# Altium schematic sheet 20-RGMII ETHERNET PHY - ICSSG PRG2_PRU0.SchDoc
size 513 x 386 mm
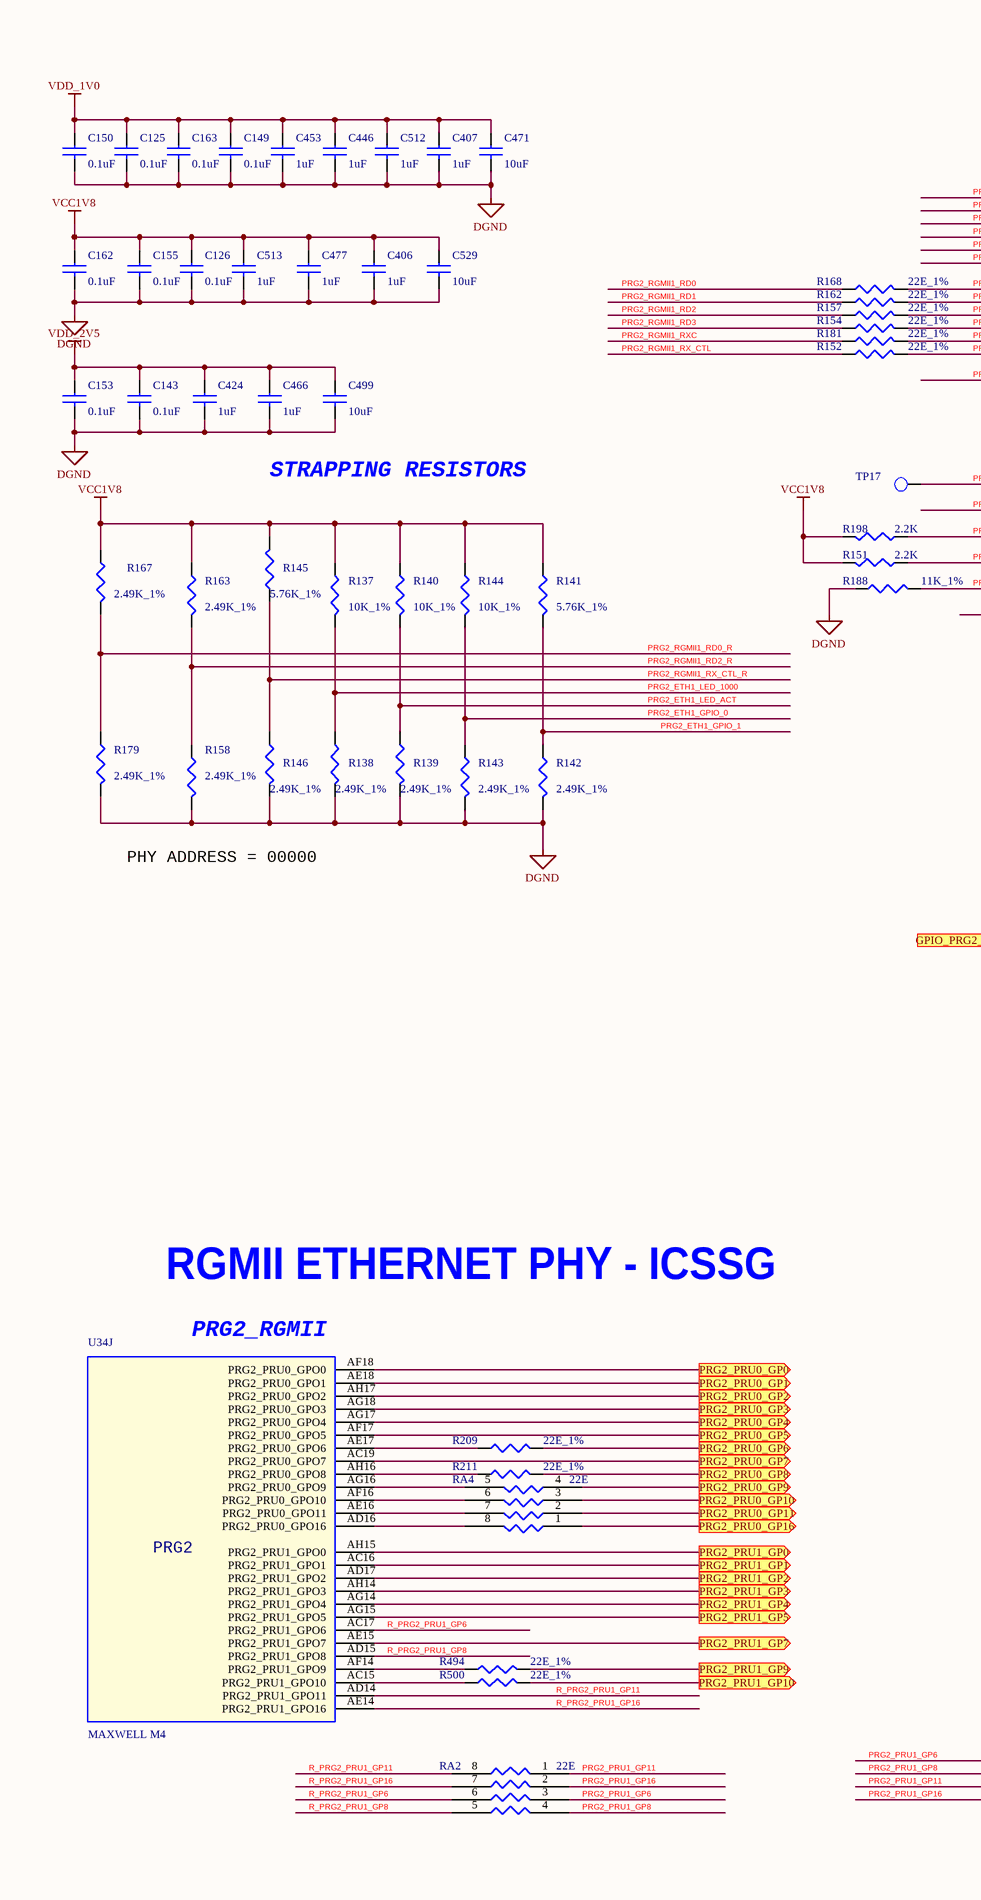
[diagram p0: 20-RGMII ETHERNET PHY - ICSSG PRG2_PRU0.SchDoc, left]
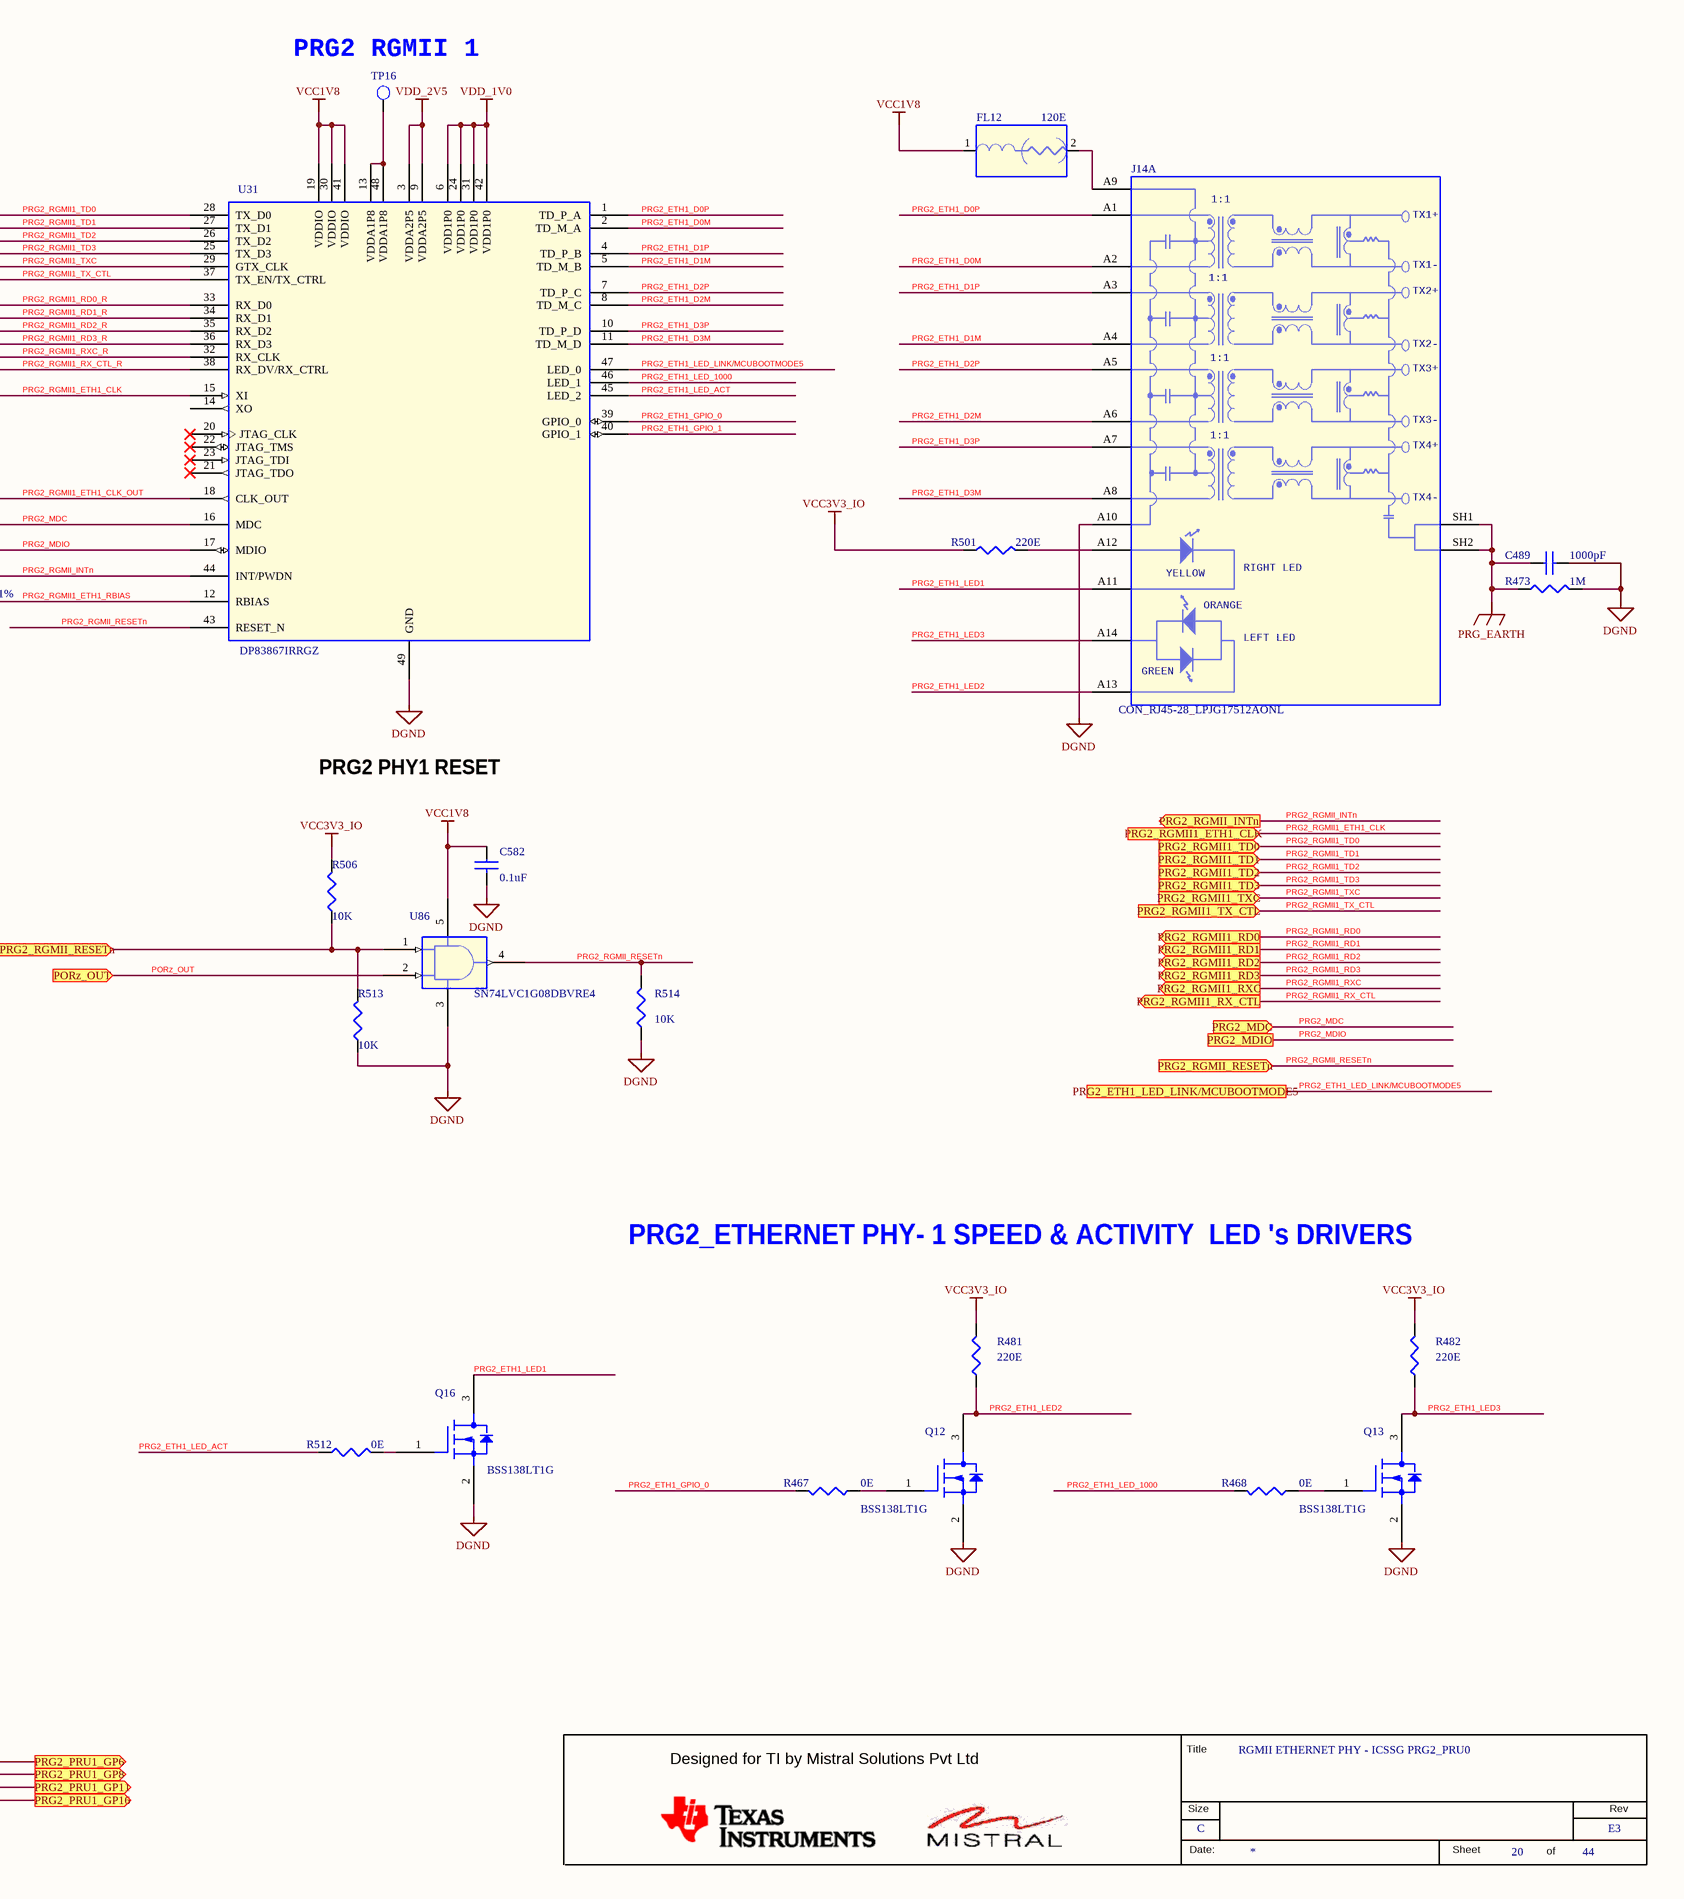
[diagram p1: 20-RGMII ETHERNET PHY - ICSSG PRG2_PRU0.SchDoc, right]

## Parts
*  RevCode: E3  Title: RGMII ETHERNET PHY - ICSSG PRG2_PRU0  Page Size: C  Page Number: 20  Page Count: 44  (hidden comment: MISTRAL_TITLEBLK_CSIZE)  (graphical)
C125  0.1uF  [CAP0201_0-5]
C126  0.1uF  [CAP0201_0-5]
C143  0.1uF  [CAP0201_0-5]
C149  0.1uF  [CAP0201_0-5]
C150  0.1uF  [CAP0201_0-5]
C153  0.1uF  [CAP0201_0-5]
C155  0.1uF  [CAP0201_0-5]
C162  0.1uF  [CAP0201_0-5]
C163  0.1uF  [CAP0201_0-5]
C406  1uF  [CAP0402_0-75]
C407  1uF  [CAP0402_0-75]
C424  1uF  [CAP0402_0-75]
C446  1uF  [CAP0402_0-75]
C453  1uF  [CAP0402_0-75]
C466  1uF  [CAP0402_0-75]
C471  10uF  [CAP0603_1]
C477  1uF  [CAP0402_0-75]
C489  1000pF  [CAP1206]
C499  10uF  [CAP0603_1]
C512  1uF  [CAP0402_0-75]
C513  1uF  [CAP0402_0-75]
C529  10uF  [CAP0603_1]
C582  0.1uF  [CAP0201_0-5]
FL12  120E  [EMIFIL_BLM15A_0402_0-6]
J14  CON_RJ45-28_LPJG17512AONL  [CON_RJ45-28_LPJG17512_S_R_T_25-3]  (part A of 2)
Q12  BSS138LT1G  [SOT23-123]
Q13  BSS138LT1G  [SOT23-123]
Q16  BSS138LT1G  [SOT23-123]
R137  10K_1%  [RES0402_0-5]
R138  2.49K_1%  [RES0402]
R139  2.49K_1%  [RES0402]
R140  10K_1%  [RES0402_0-5]
R141  5.76K_1%  [RES0402]
R142  2.49K_1%  [RES0402]
R143  2.49K_1%  [RES0402]
R144  10K_1%  [RES0402_0-5]
R145  5.76K_1%  [RES0402]
R146  2.49K_1%  [RES0402]
R151  2.2K  [RES0402_0-5]
R152  22E_1%  [RES0402]
R154  22E_1%  [RES0402]
R157  22E_1%  [RES0402]
R158  2.49K_1%  [RES0402]
R162  22E_1%  [RES0402]
R163  2.49K_1%  [RES0402]
R167  2.49K_1%  [RES0402]
R168  22E_1%  [RES0402]
R179  2.49K_1%  [RES0402]
R181  22E_1%  [RES0402]
R188  11K_1%  [RES0402_0-5]
R198  2.2K  [RES0402_0-5]
R209  22E_1%  [RES0402]
R211  22E_1%  [RES0402]
R467  0E  [RES0402_0-5]
R468  0E  [RES0402_0-5]
R473  1M  [RES0603_0-75]
R481  220E  [RES0402_0-5]
R482  220E  [RES0402_0-5]
R494  22E_1%  [RES0402]
R500  22E_1%  [RES0402]
R501  220E  [RES0402_0-5]
R506  10K  [RES0402_0-5]
R512  0E  [RES0402_0-5]
R513  10K  [RES0402_0-5]
R514  10K  [RES0402_0-5]
RA2  22E  [RESA_EXB28V_0402-4_0-5]
RA4  22E  [RESA_EXB28V_0402-4_0-5]
TP16  TP40_SMD  [TP40_SMD]  (value not drawn)
TP17  TP40_SMD  [TP40_SMD]  (value not drawn)
U31  DP83867IRRGZ  [QFN48_19-68_280X280_1]
U34  MAXWELL M4  [BGA784_31-49_910X910_1-7]  (part J of 19)
U86  SN74LVC1G08DBVRE4  [SOT23-5]

## Ports
GPIO_PRG2_RGMII_RESETn (in), PORz_OUT (in), PRG2_ETH1_LED_LINK/MCUBOOTMODE5, PRG2_MDC (in), PRG2_MDIO, PRG2_PRU0_GP0 (out), PRG2_PRU0_GP1 (out), PRG2_PRU0_GP2 (out), PRG2_PRU0_GP3 (out), PRG2_PRU0_GP4 (out), PRG2_PRU0_GP5 (out), PRG2_PRU0_GP6 (out), PRG2_PRU0_GP7 (out), PRG2_PRU0_GP8 (out), PRG2_PRU0_GP9 (out), PRG2_PRU0_GP10 (out), PRG2_PRU0_GP11 (out), PRG2_PRU0_GP16 (out), PRG2_PRU1_GP0 (out), PRG2_PRU1_GP1 (out), PRG2_PRU1_GP2 (out), PRG2_PRU1_GP3 (out), PRG2_PRU1_GP4 (out), PRG2_PRU1_GP5 (out), PRG2_PRU1_GP6 (out), PRG2_PRU1_GP7 (out), PRG2_PRU1_GP8 (out), PRG2_PRU1_GP9 (out), PRG2_PRU1_GP10 (out), PRG2_PRU1_GP11 (out), PRG2_PRU1_GP16 (out), PRG2_RGMII1_ETH1_CLK (in), PRG2_RGMII1_RD0 (out), PRG2_RGMII1_RD1 (out), PRG2_RGMII1_RD2 (out), PRG2_RGMII1_RD3 (out), PRG2_RGMII1_RX_CTL (out), PRG2_RGMII1_RXC (out), PRG2_RGMII1_TD0 (in), PRG2_RGMII1_TD1 (in), PRG2_RGMII1_TD2 (in), PRG2_RGMII1_TD3 (in), PRG2_RGMII1_TX_CTL (in), PRG2_RGMII1_TXC (in), PRG2_RGMII_INTn (out), PRG2_RGMII_RESETn (in)

## Nets
DGND: C125.2 C126.2 C143.2 C149.2 C150.2 C153.2 C155.2 C162.2 C163.2 C406.2 C407.2 C424.2 C446.2 C453.2 C466.2 C471.2 C477.2 C489.2 C499.2 C512.2 C513.2 C529.2 C582.2 J14.A10(GND) Q12.2(S) Q13.2(S) Q16.2(S) R138.2 R139.2 R142.2 R143.2 R146.2 R158.2 R179.2 R188.2 R473.2 R513.1 R514.2 U31.49(GND) U86.3(GND)
PRG_EARTH: C489.1 J14.SH1 J14.SH2 R473.1
VCC1V8: C126.1 C155.1 C162.1 C406.1 C477.1 C513.1 C529.1 C582.1 FL12.1 R137.1 R140.1 R141.1 R144.1 R145.2 R151.2 R163.1 R167.1 R198.2 U31.19(VDDIO) U31.30(VDDIO) U31.41(VDDIO) U86.5(VCC)
VCC3V3_IO: R481.2 R482.2 R501.1 R506.2
VDD_1V0: C125.1 C149.1 C150.1 C163.1 C407.1 C446.1 C453.1 C471.1 C512.1 U31.6(VDD1P0) U31.24(VDD1P0) U31.31(VDD1P0) U31.42(VDD1P0)
VDD_2V5: C143.1 C153.1 C424.1 C466.1 C499.1 U31.3(VDDA2P5) U31.9(VDDA2P5)
GPIO_PRG2_RGMII_RESETn: R506.1 R513.2 U86.1(A) ; port GPIO_PRG2_RGMII_RESETn
PORz_OUT: U86.2(B) ; port PORz_OUT
PRG2_ETH1_D0M: J14.A2(TD1-_1) U31.2(TD_M_A)
PRG2_ETH1_D0P: J14.A1(TD1+_1) U31.1(TD_P_A)
PRG2_ETH1_D1M: J14.A4(TD2-_1) U31.5(TD_M_B)
PRG2_ETH1_D1P: J14.A3(TD2+_1) U31.4(TD_P_B)
PRG2_ETH1_D2M: J14.A6(TD3-_1) U31.8(TD_M_C)
PRG2_ETH1_D2P: J14.A5(TD3+_1) U31.7(TD_P_C)
PRG2_ETH1_D3M: J14.A8(TD4-_1) U31.11(TD_M_D)
PRG2_ETH1_D3P: J14.A7(TD4+_1) U31.10(TD_P_D)
PRG2_ETH1_GPIO_0: R143.1 R144.2 R467.2 U31.39(GPIO_0)
PRG2_ETH1_GPIO_1: R141.2 R142.1 U31.40(GPIO_1)
PRG2_ETH1_LED1: J14.A11 Q16.3(D)
PRG2_ETH1_LED2: J14.A13 Q12.3(D) R481.1
PRG2_ETH1_LED3: J14.A14 Q13.3(D) R482.1
PRG2_ETH1_LED_1000: R137.2 R138.1 R468.2 U31.46(LED_1)
PRG2_ETH1_LED_ACT: R139.1 R140.2 R512.1 U31.45(LED_2)
PRG2_ETH1_LED_LINK/MCUBOOTMODE5: U31.47(LED_0) ; port PRG2_ETH1_LED_LINK/MCUBOOTMODE5
PRG2_MDC: U31.16(MDC) ; port PRG2_MDC
PRG2_MDIO: R198.1 U31.17(MDIO) ; port PRG2_MDIO
PRG2_PRU0_GP0: U34.AF18(PRG2_PRU0_GPO0) ; port PRG2_PRU0_GP0
PRG2_PRU0_GP1: U34.AE18(PRG2_PRU0_GPO1) ; port PRG2_PRU0_GP1
PRG2_PRU0_GP2: U34.AH17(PRG2_PRU0_GPO2) ; port PRG2_PRU0_GP2
PRG2_PRU0_GP3: U34.AG18(PRG2_PRU0_GPO3) ; port PRG2_PRU0_GP3
PRG2_PRU0_GP4: U34.AG17(PRG2_PRU0_GPO4) ; port PRG2_PRU0_GP4
PRG2_PRU0_GP5: U34.AF17(PRG2_PRU0_GPO5) ; port PRG2_PRU0_GP5
PRG2_PRU0_GP6: R209.2 ; port PRG2_PRU0_GP6
PRG2_PRU0_GP7: U34.AC19(PRG2_PRU0_GPO7) ; port PRG2_PRU0_GP7
PRG2_PRU0_GP8: R211.2 ; port PRG2_PRU0_GP8
PRG2_PRU0_GP9: RA4.4 ; port PRG2_PRU0_GP9
PRG2_PRU0_GP10: RA4.3 ; port PRG2_PRU0_GP10
PRG2_PRU0_GP11: RA4.2 ; port PRG2_PRU0_GP11
PRG2_PRU0_GP16: RA4.1 ; port PRG2_PRU0_GP16
PRG2_PRU1_GP0: U34.AH15(PRG2_PRU1_GPO0) ; port PRG2_PRU1_GP0
PRG2_PRU1_GP1: U34.AC16(PRG2_PRU1_GPO1) ; port PRG2_PRU1_GP1
PRG2_PRU1_GP2: U34.AD17(PRG2_PRU1_GPO2) ; port PRG2_PRU1_GP2
PRG2_PRU1_GP3: U34.AH14(PRG2_PRU1_GPO3) ; port PRG2_PRU1_GP3
PRG2_PRU1_GP4: U34.AG14(PRG2_PRU1_GPO4) ; port PRG2_PRU1_GP4
PRG2_PRU1_GP5: U34.AG15(PRG2_PRU1_GPO5) ; port PRG2_PRU1_GP5
PRG2_PRU1_GP6: RA2.3 ; port PRG2_PRU1_GP6
PRG2_PRU1_GP7: U34.AE15(PRG2_PRU1_GPO7) ; port PRG2_PRU1_GP7
PRG2_PRU1_GP8: RA2.4 ; port PRG2_PRU1_GP8
PRG2_PRU1_GP9: R494.2 ; port PRG2_PRU1_GP9
PRG2_PRU1_GP10: R500.2 ; port PRG2_PRU1_GP10
PRG2_PRU1_GP11: RA2.1 ; port PRG2_PRU1_GP11
PRG2_PRU1_GP16: RA2.2 ; port PRG2_PRU1_GP16
PRG2_RGMII1_ETH1_CLK: U31.15(XI) ; port PRG2_RGMII1_ETH1_CLK
PRG2_RGMII1_ETH1_CLK_OUT: TP17.1(TP) U31.18(CLK_OUT)
PRG2_RGMII1_ETH1_RBIAS: R188.1 U31.12(RBIAS)
PRG2_RGMII1_RD0: R168.1 ; port PRG2_RGMII1_RD0
PRG2_RGMII1_RD0_R: R167.2 R168.2 R179.1 U31.33(RX_D0)
PRG2_RGMII1_RD1: R162.1 ; port PRG2_RGMII1_RD1
PRG2_RGMII1_RD1_R: R162.2 U31.34(RX_D1)
PRG2_RGMII1_RD2: R157.1 ; port PRG2_RGMII1_RD2
PRG2_RGMII1_RD2_R: R157.2 R158.1 R163.2 U31.35(RX_D2)
PRG2_RGMII1_RD3: R154.1 ; port PRG2_RGMII1_RD3
PRG2_RGMII1_RD3_R: R154.2 U31.36(RX_D3)
PRG2_RGMII1_RX_CTL: R152.1 ; port PRG2_RGMII1_RX_CTL
PRG2_RGMII1_RX_CTL_R: R145.1 R146.1 R152.2 U31.38(RX_DV/RX_CTRL)
PRG2_RGMII1_RXC: R181.1 ; port PRG2_RGMII1_RXC
PRG2_RGMII1_RXC_R: R181.2 U31.32(RX_CLK)
PRG2_RGMII1_TD0: U31.28(TX_D0) ; port PRG2_RGMII1_TD0
PRG2_RGMII1_TD1: U31.27(TX_D1) ; port PRG2_RGMII1_TD1
PRG2_RGMII1_TD2: U31.26(TX_D2) ; port PRG2_RGMII1_TD2
PRG2_RGMII1_TD3: U31.25(TX_D3) ; port PRG2_RGMII1_TD3
PRG2_RGMII1_TX_CTL: U31.37(TX_EN/TX_CTRL) ; port PRG2_RGMII1_TX_CTL
PRG2_RGMII1_TXC: U31.29(GTX_CLK) ; port PRG2_RGMII1_TXC
PRG2_RGMII_INTn: R151.1 U31.44(INT/PWDN) ; port PRG2_RGMII_INTn
PRG2_RGMII_RESETn: R514.1 U31.43(RESET_N) U86.4(Y) ; port PRG2_RGMII_RESETn
R_PRG2_PRU1_GP6: RA2.6 U34.AC17(PRG2_PRU1_GPO6)
R_PRG2_PRU1_GP8: RA2.5 U34.AD15(PRG2_PRU1_GPO8)
R_PRG2_PRU1_GP11: RA2.8 U34.AD14(PRG2_PRU1_GPO11)
R_PRG2_PRU1_GP16: RA2.7 U34.AE14(PRG2_PRU1_GPO16)
NetFL12_2: FL12.2 J14.A9(VCC)
NetJ14_A12: J14.A12 R501.2
NetQ12_1: Q12.1(G) R467.1
NetQ13_1: Q13.1(G) R468.1
NetQ16_1: Q16.1(G) R512.2
NetR209_1: R209.1 U34.AE17(PRG2_PRU0_GPO6)
NetR211_1: R211.1 U34.AH16(PRG2_PRU0_GPO8)
NetR494_1: R494.1 U34.AF14(PRG2_PRU1_GPO9)
NetR500_1: R500.1 U34.AC15(PRG2_PRU1_GPO10)
NetRA4_5: RA4.5 U34.AG16(PRG2_PRU0_GPO9)
NetRA4_6: RA4.6 U34.AF16(PRG2_PRU0_GPO10)
NetRA4_7: RA4.7 U34.AE16(PRG2_PRU0_GPO11)
NetRA4_8: RA4.8 U34.AD16(PRG2_PRU0_GPO16)
NetTP16_1: TP16.1(TP) U31.13(VDDA1P8) U31.48(VDDA1P8)

Not connected (* = marked no-connect by the designer): U31 14(XO) 20(JTAG_CLK)* 21(JTAG_TDO)* 22(JTAG_TMS)* 23(JTAG_TDI)*

## Notes on the sheet
- (near TP16) PRG2 RGMII 1
- STRAPPING RESISTORS
- PRG2 PHY1 RESET
- PHY ADDRESS = 00000
- PRG2_ETHERNET PHY- 1 SPEED & ACTIVITY  LED 's DRIVERS
- RGMII ETHERNET PHY - ICSSG
- (near U34) PRG2_RGMII
- (in symbol AM654X_BGA784, part J) PRG2
- (in symbol CON_RJ45-28_LPJG17512AONL, part A) 1:1; TX1+; TX1-; TX2+; TX2-; TX3+; TX3-; TX4+; TX4-; RIGHT LED; YELLOW; ORANGE; LEFT LED; GREEN
- (in symbol MISTRAL_TITLEBLK_CSIZE) Title; Designed for TI by Mistral Solutions Pvt Ltd; Size; Rev; Date:; Sheet; of

## Library data of the parts
* = MISTRAL_TITLEBLK_CSIZE: Issue: 1.0; Page Create Date: March  8, 1995; Page Modify Date: *
C125 C150 C153 C582 = CAP_Dup5: CAP CERAMIC 0.1uF 16V 10% X5R 0201; Part_type: CAPACITORS\CERAMIC; Mfr_part_number: GRM033R61C104KE84J; Mfr_name: MURATA; Mistral Part No: 120009030072-R; Custom_Duty: 15%; Customs_HS_Code: 85322990; Wattage: NA; Project: TI_MAXIE_CPB; Library Ref: CAP; PCB Footprint: CAP0201_0-5; MECHANICAL 3D STEP FILE: CAP0201_0-5; Chkd/date: MANIRAJA/120218; Crtd /date: MANIRAJA/120218; Datasheet: Y:\MIS_DATABASE\DATASHEETS\CAPACITORS\GRM033R61C104KE84.PDF; Temperature: -55°C+85°C; Weight: 0.33mg; Height: 0.33MM; Distributor_part_number: 490-16742-1-ND; Distributor_name: DIGIKEY; Package: 0201; Voltage: 16V; Tolerance: 10%
C126 C143 C149 C155 C162 C163 = CAP_Dup5: CAP CERAMIC 0.1uF 16V 10% X5R 0201; Mistral Part No: 120009030072-R; Mfr_name: MURATA; Mfr_part_number: GRM033R61C104KE84J; Part_type: CAPACITORS\CERAMIC; Project: TI_MAXIE_CPB; Wattage: NA; Customs_HS_Code: 85322990; Custom_Duty: 15%; Library Ref: CAP; PCB Footprint: CAP0201_0-5; Tolerance: 10%; Voltage: 16V; Package: 0201; Distributor_name: DIGIKEY; Distributor_part_number: 490-16742-1-ND; Height: 0.33MM; Weight: 0.33mg; Temperature: -55°C+85°C; Datasheet: Y:\MIS_DATABASE\DATASHEETS\CAPACITORS\GRM033R61C104KE84.PDF; Crtd /date: MANIRAJA/120218; Chkd/date: MANIRAJA/120218; MECHANICAL 3D STEP FILE: CAP0201_0-5
C406 C407 C446 C477 C513 = CAP_Dup5: CAP CERAMIC 1uF 16V 20% X5R 0402; Mistral Part No: 120018020006-R; Mfr_name: TAIYO YUDEN; Mfr_part_number: EMK105BJ105MV-F; Part_type: CAPACITORS\CERAMIC; Project: TI_MAXIE_CPB; Wattage: NA; Customs_HS_Code: 85322990; Custom_Duty: 15%; Footprint Ref: CAP0402_0-75; Library Ref: CAP; Footprint Path: Y:\MIS_DATABASE\Library\ALTIUM_TOOL\PCB_FOOTPRINTS\Altium_Footprint_Lib.PcbLib; Library Path: Y:\MIS_DATABASE\Library\ALTIUM_TOOL\SCHEMATICS_PARTS\MS_DISCRETE_Library.schlib; MECHANICAL 3D STEP FILE: CAP0402_0-75; PCB Footprint: CAP0402_0-75; Tolerance: 20%; Voltage: 16V; Package: 0402; Distributor_name: DIGIKEY; Distributor_part_number: 587-5514-1-ND; Height: 0.55MM; Weight: 0.65mg; Temperature: -55°C+85°C; Datasheet: Y:\MIS_DATABASE\DATASHEETS\CAPACITORS\EMK105BJ105MV-F.PDF; Crtd /date: ALVY/150218; Chkd/date: MANIRAJA/150218
C424 C453 C466 C512 = CAP_Dup5: CAP CERAMIC 1uF 16V 20% X5R 0402; Part_type: CAPACITORS\CERAMIC; Mfr_part_number: EMK105BJ105MV-F; Mfr_name: TAIYO YUDEN; Mistral Part No: 120018020006-R; Custom_Duty: 15%; Customs_HS_Code: 85322990; Wattage: NA; Project: TI_MAXIE_CPB; Footprint Ref: CAP0402_0-75; Library Ref: CAP; Footprint Path: Y:\MIS_DATABASE\Library\ALTIUM_TOOL\PCB_FOOTPRINTS\Altium_Footprint_Lib.PcbLib; Library Path: Y:\MIS_DATABASE\Library\ALTIUM_TOOL\SCHEMATICS_PARTS\MS_DISCRETE_Library.schlib; MECHANICAL 3D STEP FILE: CAP0402_0-75; PCB Footprint: CAP0402_0-75; Chkd/date: MANIRAJA/150218; Crtd /date: ALVY/150218; Datasheet: Y:\MIS_DATABASE\DATASHEETS\CAPACITORS\EMK105BJ105MV-F.PDF; Temperature: -55°C+85°C; Weight: 0.65mg; Height: 0.55MM; Distributor_part_number: 587-5514-1-ND; Distributor_name: DIGIKEY; Package: 0402; Voltage: 16V; Tolerance: 20%
C471 = CAP_Dup5: CAP CERAMIC 10uF 10V 10% X5R 0603; Mistral Part No: 120010080001-R; Mfr_name: AVX CORPORATION; Mfr_part_number: 0603ZD106KAT2A; Part_type: CAPACITORS\CERAMIC; Project: TI_MAXIE_CPB; Customs_HS_Code: 85322990; Custom_Duty: 15%; Wattage: NA; Library Ref: CAP; PCB Footprint: CAP0603_1; Tolerance: 10%; Voltage: 10V; Package: 0603; Distributor_name: DIGIKEY; Distributor_part_number: 478-10766-1-ND; Height: 0.94MM; Datasheet: Y:\MIS_DATABASE\DATASHEETS\CAPACITORS\AVX_MLC.PDF; Crtd /date: MANIRAJA/230118; Chkd/date: MANIRAJA/230118; Weight: 2mg; Temperature: -55°C+85°C; MECHANICAL 3D STEP FILE: CAP0603_1
C489 = CAP_Dup5: CAP CERAMIC 1000pF 2KV 10% X7R 1206; Mistral Part No: 120009030147-R; Mfr_name: AVX CORPORATION; Mfr_part_number: 1206GC102KAT1A; Part_type: CAPACITORS\CERAMIC; Project: ADR1B; Customs_HS_Code: 85322990; Custom_Duty: 15%; Footprint Path: Y:\MIS_DATABASE\Library\ALTIUM_TOOL\PCB_FOOTPRINTS\Altium_Footprint_Lib.PcbLib; Library Path: Y:\MIS_DATABASE\Library\ALTIUM_TOOL\SCHEMATICS_PARTS\MS_DISCRETE_Library.schlib; Footprint Ref: CAP1206; Library Ref: CAP; Tolerance: 10%; Voltage: 2KV; Package: 1206; Distributor_name: DIGIKEY; Distributor_part_number: 478-2956-1-ND; Height: 1.50MM; Weight: NA; Temperature: -55°C+125°C; Datasheet: Y:\MIS_DATABASE\DATASHEETS\CAPACITORS\AVX_MLC.PDF; Crtd /date: MAZHAR/281106; Chkd/date: SHREESHAIL/291106; PCB Footprint: CAP1206
C499 = CAP_Dup5: CAP CERAMIC 10uF 10V 10% X5R 0603; Part_type: CAPACITORS\CERAMIC; Mfr_part_number: 0603ZD106KAT2A; Mfr_name: AVX CORPORATION; Mistral Part No: 120010080001-R; Wattage: NA; Custom_Duty: 15%; Customs_HS_Code: 85322990; Project: TI_MAXIE_CPB; Library Ref: CAP; PCB Footprint: CAP0603_1; MECHANICAL 3D STEP FILE: CAP0603_1; Temperature: -55°C+85°C; Weight: 2mg; Chkd/date: MANIRAJA/230118; Crtd /date: MANIRAJA/230118; Datasheet: Y:\MIS_DATABASE\DATASHEETS\CAPACITORS\AVX_MLC.PDF; Height: 0.94MM; Distributor_part_number: 478-10766-1-ND; Distributor_name: DIGIKEY; Package: 0603; Voltage: 10V; Tolerance: 10%
C529 = CAP_Dup5: CAP CERAMIC 10uF 10V 10% X5R 0603; Mistral Part No: 120010080001-R; Mfr_name: AVX CORPORATION; Mfr_part_number: 0603ZD106KAT2A; Part_type: CAPACITORS\CERAMIC; Wattage: NA; Project: TI_MAXIE_CPB; Customs_HS_Code: 85322990; Custom_Duty: 15%; Library Ref: CAP; PCB Footprint: CAP0603_1; MECHANICAL 3D STEP FILE: CAP0603_1; Temperature: -55°C+85°C; Weight: 2mg; Tolerance: 10%; Voltage: 10V; Package: 0603; Distributor_name: DIGIKEY; Distributor_part_number: 478-10766-1-ND; Height: 0.94MM; Datasheet: Y:\MIS_DATABASE\DATASHEETS\CAPACITORS\AVX_MLC.PDF; Crtd /date: MANIRAJA/230118; Chkd/date: MANIRAJA/230118
FL12 = EMIFILTER_IND: FERRITE CHIP 120E 1.3A 0402; Part_type: MISC\FILTER; Mfr_part_number: BLM15PD121SN1; Mfr_name: MURATA; Mistral Part No: 130012030043-R; Custom_Duty: 24%; Customs_HS_Code: 85437099; Wattage: NA; Tolerance: 25%; Project: GEN_3-8; Footprint Path: Y:\MIS_DATABASE\Library\ALTIUM_TOOL\PCB_FOOTPRINTS\Altium_Footprint_Lib.PcbLib; Library Path: Y:\MIS_DATABASE\Library\ALTIUM_TOOL\SCHEMATICS_PARTS\MS_FILTER_Library.schlib; Footprint Ref: EMIFIL_BLM15A_0402_0-6; Library Ref: EMIFILTER_IND; PCB Footprint: EMIFIL_BLM15A_0402_0-6; MECHANICAL 3D STEP FILE: EMIFIL_BLM15A_0402_0-6; Chkd/date: VASANTHA/010117; Crtd /date: CHAITHANYA/150312; Datasheet: Y:\MIS_DATABASE\DATASHEETS\DISCRETES\INDUCTORS\BLM18K-SERIES.PDF; Temperature: -55°C+125°C; Weight: 0.65mg; Height: 0.55MM; Distributor_part_number: 490-5203-1-ND; Distributor_name: DIGIKEY; Package: 0402; Voltage: NA
J14 = CON_RJ45-28_LPJG17512AONL: CON JACK RJ45 28POS REGISTERED FEMALE RA TH; Part_type: CONNECTOR\JACK; Mfr_name: LINK-PP; Mistral Part No: 150017080001-R; Custom_Duty: 24%; Customs_HS_Code: 85369090; Wattage: NA; Project: TI_SVB_DUT; Library Ref: CON_RJ45-28_LPJG17512AONL; PCB Footprint: CON_RJ45-28_LPJG17512_S_R_T_25-3; MECHANICAL 3D STEP FILE: CON_RJ45-28_LPJG17512_S_R_T_25-3; Chkd/date: MANIRAJA/010817; Crtd /date: MANIRAJA/010817; Datasheet: Y:\MIS_DATABASE\DATASHEETS\CONNECTORS\LPJG17512AONL.PDF; Temperature: 0°C+70°C; Weight: NA; Height: 25.30MM; Distributor_part_number: NA; Distributor_name: NA; Package: THRU-HOLE; Voltage: NA; Tolerance: NA; Mfr_part_number: LPJG17512AONL
Q12 Q16 = MOSFET_BSS138LT1G: IC MOSFET N-CHANNEL 50V, SOT23-3; Part_type: ICS\POWER\MOSFET; Mfr_name: ON SEMICONDUCTOR; Mistral Part No: 142016040001-R; Custom_Duty: 15%; Customs_HS_Code: 85423100; Wattage: NA; Project: LRDE_ABCM; Library Ref: MOSFET_BSS138LT1G; PCB Footprint: SOT23-123; Chkd/date: VASANTHA/150416; Crtd /date: JEBRAN/060416; Datasheet: Y:\MIS_DATABASE\DATASHEETS\DISCRETES\TRANSISTORS_FETS\BSS138LT1G.PDF; Temperature: -55°C+150°C; Weight: NA; Height: 1.11MM; Distributor_part_number: 863-BSS138LT1G; Distributor_name: MOUSER; Package: SOT23-3; Voltage: 50V; Tolerance: NA; Mfr_part_number: BSS138LT1G
Q13 = MOSFET_BSS138LT1G: IC MOSFET N-CHANNEL 50V, SOT23-3; Mistral Part No: 142016040001-R; Mfr_name: ON SEMICONDUCTOR; Part_type: ICS\POWER\MOSFET; Project: LRDE_ABCM; Tolerance: NA; Customs_HS_Code: 85423100; Custom_Duty: 15%; Library Ref: MOSFET_BSS138LT1G; PCB Footprint: SOT23-123; Mfr_part_number: BSS138LT1G; Voltage: 50V; Wattage: NA; Package: SOT23-3; Distributor_name: MOUSER; Distributor_part_number: 863-BSS138LT1G; Height: 1.11MM; Weight: NA; Temperature: -55°C+150°C; Datasheet: Y:\MIS_DATABASE\DATASHEETS\DISCRETES\TRANSISTORS_FETS\BSS138LT1G.PDF; Crtd /date: JEBRAN/060416; Chkd/date: VASANTHA/150416
R137 R140 = RESISTOR_Dup5: RES 10K 1/16W 1% 0402; Mistral Part No: 110009030220-P; Mfr_name: YAGEO AMERICA; Mfr_part_number: RC0402FR-0710KL; Part_type: RESISTORS\FIXED; Project: VOCERA; Voltage: NA; Customs_HS_Code: 85332119; Custom_Duty: 15%; NI_MARK: DNI; Footprint Path: Y:\MIS_DATABASE\Library\ALTIUM_TOOL\PCB_FOOTPRINTS\Altium_Footprint_Lib.PcbLib; Library Path: Y:\MIS_DATABASE\Library\ALTIUM_TOOL\SCHEMATICS_PARTS\MS_DISCRETE_Library.schlib; Footprint Ref: RES0402_0-5; Library Ref: RESISTOR; MECHANICAL 3D STEP FILE: RES0402_0-5; Tolerance: 1%; Wattage: 1/16W; Package: 0402; Distributor_name: DIGIKEY; Distributor_part_number: 311-10.0KLRTR-ND; Height: 0.40MM; Weight: 0.65mg; Temperature: -55°C+155°C; Datasheet: Y:\MIS_DATABASE\DATASHEETS\RESISTORS\YAGEO-RC0402.PDF; Crtd /date: GEETHA/290506; Chkd/date: VASANTHA/201216; RoHS: Pb-Free; PCB Footprint: RES0402_0-5
R138 R139 R179 = RESISTOR_Dup5: RES 2.49K 1/16W 1% 0402; Mistral Part No: 110016050020-R; Mfr_name: YAGEO AMERICA; Mfr_part_number: RC0402FR-072K49L; Part_type: RESISTORS\FIXED; Project: TMDXCSKCC; Voltage: NA; Customs_HS_Code: 85332119; Custom_Duty: 15%; NI_MARK: DNI; Library Ref: RESISTOR; Tolerance: 1%; Wattage: 1/16W; Package: 0402; Distributor_name: DIGIKEY; Distributor_part_number: 311-2.49KLRCT-ND; Height: 0.40MM; Weight: NA; Temperature: -55°C+155°C; Datasheet: Y:\MIS_DATABASE\DATASHEETS\RESISTORS\RC0402FR.PDF; Crtd /date: VASANTHA/270516; Chkd/date: VASANTHA/270516; PCB Footprint: RES0402
R141 = RESISTOR_Dup5: RES 5.76K 1/10W 1% 0402; Part_type: RESISTORS\FIXED; Mfr_part_number: ERJ-2RKF5761X; Mfr_name: PANASONIC-ECG; Mistral Part No: 110009030945-R; Custom_Duty: 15%; Customs_HS_Code: 85332119; Project: CPB; NI_MARK: DNI; Footprint Path: Y:\MIS_DATABASE\Library\ALTIUM_TOOL\PCB_FOOTPRINTS\Altium_Footprint_Lib.PcbLib; Library Path: Y:\MIS_DATABASE\Library\ALTIUM_TOOL\SCHEMATICS_PARTS\MS_DISCRETE_Library.schlib; Library Ref: RESISTOR; Chkd/date: MAZHAR/150709; Crtd /date: USMAN/220808; Datasheet: Y:\MIS_DATABASE\DATASHEETS\RESISTORS\PAN-ERJSERIES.PDF; Height: 0.40MM; Distributor_part_number: P5.76KLCT-ND; Distributor_name: DIGIKEY; Package: 0402; Wattage: 1/10W; Tolerance: 1%; PCB Footprint: RES0402
R142 R143 R146 R158 R163 R167 = RESISTOR_Dup5: RES 2.49K 1/16W 1% 0402; Part_type: RESISTORS\FIXED; Mfr_part_number: RC0402FR-072K49L; Mfr_name: YAGEO AMERICA; Mistral Part No: 110016050020-R; Custom_Duty: 15%; Customs_HS_Code: 85332119; Voltage: NA; Project: TMDXCSKCC; NI_MARK: DNI; Library Ref: RESISTOR; Chkd/date: VASANTHA/270516; Crtd /date: VASANTHA/270516; Datasheet: Y:\MIS_DATABASE\DATASHEETS\RESISTORS\RC0402FR.PDF; Temperature: -55°C+155°C; Weight: NA; Height: 0.40MM; Distributor_part_number: 311-2.49KLRCT-ND; Distributor_name: DIGIKEY; Package: 0402; Wattage: 1/16W; Tolerance: 1%; PCB Footprint: RES0402
R144 = RESISTOR_Dup5: RES 10K 1/16W 1% 0402; Part_type: RESISTORS\FIXED; Mfr_part_number: RC0402FR-0710KL; Mfr_name: YAGEO AMERICA; Mistral Part No: 110009030220-P; Custom_Duty: 15%; Customs_HS_Code: 85332119; Voltage: NA; Project: VOCERA; NI_MARK: DNI; Footprint Path: Y:\MIS_DATABASE\Library\ALTIUM_TOOL\PCB_FOOTPRINTS\Altium_Footprint_Lib.PcbLib; Library Path: Y:\MIS_DATABASE\Library\ALTIUM_TOOL\SCHEMATICS_PARTS\MS_DISCRETE_Library.schlib; Footprint Ref: RES0402_0-5; Library Ref: RESISTOR; MECHANICAL 3D STEP FILE: RES0402_0-5; RoHS: Pb-Free; Chkd/date: VASANTHA/201216; Crtd /date: GEETHA/290506; Datasheet: Y:\MIS_DATABASE\DATASHEETS\RESISTORS\YAGEO-RC0402.PDF; Temperature: -55°C+155°C; Weight: 0.65mg; Height: 0.40MM; Distributor_part_number: 311-10.0KLRTR-ND; Distributor_name: DIGIKEY; Package: 0402; Wattage: 1/16W; Tolerance: 1%; PCB Footprint: RES0402_0-5
R145 = RESISTOR_Dup5: RES 5.76K 1/10W 1% 0402; Mistral Part No: 110009030945-R; Mfr_name: PANASONIC-ECG; Mfr_part_number: ERJ-2RKF5761X; Part_type: RESISTORS\FIXED; Project: CPB; Customs_HS_Code: 85332119; Custom_Duty: 15%; NI_MARK: DNI; Footprint Path: Y:\MIS_DATABASE\Library\ALTIUM_TOOL\PCB_FOOTPRINTS\Altium_Footprint_Lib.PcbLib; Library Path: Y:\MIS_DATABASE\Library\ALTIUM_TOOL\SCHEMATICS_PARTS\MS_DISCRETE_Library.schlib; Library Ref: RESISTOR; Tolerance: 1%; Wattage: 1/10W; Package: 0402; Distributor_name: DIGIKEY; Distributor_part_number: P5.76KLCT-ND; Height: 0.40MM; Datasheet: Y:\MIS_DATABASE\DATASHEETS\RESISTORS\PAN-ERJSERIES.PDF; Crtd /date: USMAN/220808; Chkd/date: MAZHAR/150709; PCB Footprint: RES0402
R151 = RESISTOR_Dup5: RES 2.2K 1/16W 5% 0402; Mistral Part No: 110010120018-R; Mfr_name: YAGEO AMERICA; Mfr_part_number: RC0402JR-072K2L; Part_type: RESISTORS\FIXED; Project: TE4; Voltage: NA; Customs_HS_Code: 85332119; Custom_Duty: 15%; Library Ref: RESISTOR; PCB Footprint: RES0402_0-5; Tolerance: 5%; Wattage: 1/16W; Package: 0402; Distributor_name: DIGIKEY; Distributor_part_number: 311-2.2KJRCT-ND; Height: 0.40MM; Weight: 0.65mg; Temperature: -55°C+155°C; Datasheet: Y:\MIS_DATABASE\DATASHEETS\RESISTORS\YAGEO.PDF; Crtd /date: BAVISH/021210; Chkd/date: VASANTHA/061216; MECHANICAL 3D STEP FILE: RES0402_0-5; Footprint Path: VALUE IS VAILABLE 3 TIMES
R152 R157 R168 R209 R500 = RESISTOR_Dup5: RES 22E 1/16W 1% 0402; Mistral Part No: 110009090004-P; Mfr_name: YAGEO AMERICA; Mfr_part_number: RC0402FR-0722RL; Part_type: RESISTORS\FIXED; Alternate_mfr_name_A: VISHAY; Alternate_mfr_part_number_A: CRCW040222R0FKED; Cust_part_number: 4700-80047E; Project: VMEFMCD; Voltage: 50V; Customs_HS_Code: 85332119; Custom_Duty: 15%; Remarks: In alternate datasheet it is RoHS COMPLIANT. Y:\MIS_DATABASE\DATASHEETS\RESISTORS\CRCW0402.PDF; Library Ref: RESISTOR; PCB Footprint: RES0402; Tolerance: 1%; Wattage: 1/16W; Package: 0402; Distributor_name: DIGIKEY; Distributor_part_number: 311-22.0LRCT-ND; Distributor_name_A: DIGIKEY; Distributor_part_number_A: 541-22.0LCT-ND; Height: 0.40MM; Weight: 0.8g/1000pcs; Temperature: -55°C+155°C; Datasheet: Y:\MIS_DATABASE\DATASHEETS\RESISTORS\YAGEO-RC0402.PDF; Crtd /date: MAZHAR/090909; Chkd/date: SUHAS/290910; RoHS: Pb-Free; SIGNAL_MODEL: RES
R154 R162 R181 R211 R494 = RESISTOR_Dup5: RES 22E 1/16W 1% 0402; Cust_part_number: 4700-80047E; Alternate_mfr_part_number_A: CRCW040222R0FKED; Alternate_mfr_name_A: VISHAY; Part_type: RESISTORS\FIXED; Mfr_part_number: RC0402FR-0722RL; Mfr_name: YAGEO AMERICA; Mistral Part No: 110009090004-P; Remarks: In alternate datasheet it is RoHS COMPLIANT. Y:\MIS_DATABASE\DATASHEETS\RESISTORS\CRCW0402.PDF; Custom_Duty: 15%; Customs_HS_Code: 85332119; Voltage: 50V; Project: VMEFMCD; Library Ref: RESISTOR; PCB Footprint: RES0402; RoHS: Pb-Free; Chkd/date: SUHAS/290910; Crtd /date: MAZHAR/090909; Datasheet: Y:\MIS_DATABASE\DATASHEETS\RESISTORS\YAGEO-RC0402.PDF; Temperature: -55°C+155°C; Weight: 0.8g/1000pcs; Height: 0.40MM; Distributor_part_number_A: 541-22.0LCT-ND; Distributor_name_A: DIGIKEY; Distributor_part_number: 311-22.0LRCT-ND; Distributor_name: DIGIKEY; Package: 0402; Wattage: 1/16W; Tolerance: 1%; SIGNAL_MODEL: RES
R188 = RESISTOR_Dup5: RES 11K 1/16W 1% 0402; Mistral Part No: 110015110012-P; Mfr_name: YAGEO AMERICA; Mfr_part_number: RC0402FR-0711KL; Part_type: RESISTORS\FIXED; Project: TI_VLAN_SWITCH; Voltage: NA; Customs_HS_Code: 85332119; Custom_Duty: 15%; Library Ref: RESISTOR; Tolerance: 1%; Wattage: 1/16W; Package: 0402; Distributor_name: DIGIKEY; Distributor_part_number: 311-11.0KLRCT-ND; Height: 0.40MM; Weight: 0.65mg; Temperature: -55°C+155°C; Datasheet: Y:\MIS_DATABASE\DATASHEETS\RESISTORS\YAGEO-RC0402.PDF; Crtd /date: VASANTHA/251115; Chkd/date: VASANTHA/251115; RoHS: Pb-Free; MECHANICAL 3D STEP FILE: RES0402_0-5; PCB Footprint: RES0402_0-5
R198 = RESISTOR_Dup5: RES 2.2K 1/16W 5% 0402; Part_type: RESISTORS\FIXED; Mfr_part_number: RC0402JR-072K2L; Mfr_name: YAGEO AMERICA; Mistral Part No: 110010120018-R; Custom_Duty: 15%; Customs_HS_Code: 85332119; Voltage: NA; Project: TE4; Library Ref: RESISTOR; PCB Footprint: RES0402_0-5; Footprint Path: VALUE IS VAILABLE 3 TIMES; MECHANICAL 3D STEP FILE: RES0402_0-5; Chkd/date: VASANTHA/061216; Crtd /date: BAVISH/021210; Datasheet: Y:\MIS_DATABASE\DATASHEETS\RESISTORS\YAGEO.PDF; Temperature: -55°C+155°C; Weight: 0.65mg; Height: 0.40MM; Distributor_part_number: 311-2.2KJRCT-ND; Distributor_name: DIGIKEY; Package: 0402; Wattage: 1/16W; Tolerance: 5%
R467 = RESISTOR_Dup4: RES 0E 1/16W 0402; Part_type: RESISTORS\FIXED; Mfr_part_number: CRCW04020000Z0ED; Mfr_name: VISHAY; Mistral Part No: 110010080019-P; Custom_Duty: 15%; Customs_HS_Code: 85332119; Voltage: NA; Project: PB_BUGBASE; Footprint Path: Y:\MIS_DATABASE\Library\ALTIUM_TOOL\PCB_FOOTPRINTS\Altium_Footprint_Lib.PcbLib; Library Path: Y:\MIS_DATABASE\Library\ALTIUM_TOOL\SCHEMATICS_PARTS\MS_DISCRETE_Library.schlib; Footprint Ref: RES0402_0-5; Library Ref: RESISTOR; PCB Footprint: RES0402_0-5; RoHS: Pb-Free; Chkd/date: VASANTHA/201216; Crtd /date: MUDDU/190810; Datasheet: Y:\MIS_DATABASE\DATASHEETS\RESISTORS\CRCW0603.PDF; Temperature: -55°C+155°C; Weight: 0.65g/1000pcs; Height: 0.40MM; Distributor_part_number: 541-0.0JCT-ND; Distributor_name: DIGIKEY; Package: 0402; Wattage: 1/16W; Tolerance: NA; MECHANICAL 3D STEP FILE: RES0402_0-5
R468 R512 = RESISTOR_Dup4: RES 0E 1/16W 0402; Mistral Part No: 110010080019-P; Mfr_name: VISHAY; Mfr_part_number: CRCW04020000Z0ED; Part_type: RESISTORS\FIXED; Project: PB_BUGBASE; Tolerance: NA; Customs_HS_Code: 85332119; Custom_Duty: 15%; Footprint Path: Y:\MIS_DATABASE\Library\ALTIUM_TOOL\PCB_FOOTPRINTS\Altium_Footprint_Lib.PcbLib; Library Path: Y:\MIS_DATABASE\Library\ALTIUM_TOOL\SCHEMATICS_PARTS\MS_DISCRETE_Library.schlib; Footprint Ref: RES0402_0-5; Library Ref: RESISTOR; PCB Footprint: RES0402_0-5; Voltage: NA; Wattage: 1/16W; Package: 0402; Distributor_name: DIGIKEY; Distributor_part_number: 541-0.0JCT-ND; Height: 0.40MM; Weight: 0.65g/1000pcs; Temperature: -55°C+155°C; Datasheet: Y:\MIS_DATABASE\DATASHEETS\RESISTORS\CRCW0603.PDF; Crtd /date: MUDDU/190810; Chkd/date: VASANTHA/201216; RoHS: Pb-Free; MECHANICAL 3D STEP FILE: RES0402_0-5
R473 = RESISTOR_Dup5: RES 1M 1/10W 5% 0603; Part_type: RESISTORS\FIXED; Mfr_part_number: ERJ-3GEYJ105V; Mfr_name: PANASONIC-ECG; Mistral Part No: 110009030413-R; Custom_Duty: 15%; Customs_HS_Code: 85332119; Voltage: NA; Project: BSN; Library Ref: RESISTOR; Chkd/date: VASANTHA/060217; Crtd /date: USMAN/111207; Datasheet: Y:\MIS_DATABASE\DATASHEETS\RESISTORS\PAN-ERJ-3GE.PDF; Temperature: -55°C+155°C; Weight: 2mg; Height: 0.55MM; Distributor_part_number: P1.0MGCT-ND; Distributor_name: DIGIKEY; Package: 0603; Wattage: 1/10W; Tolerance: 5%; MECHANICAL 3D STEP FILE: RES0603_0-75; PCB Footprint: RES0603_0-75
R481 = RESISTOR_Dup5: RES 220E 1/16W 5% 0402; Part_type: RESISTORS\FIXED; Mfr_part_number: ERJ-2GEJ221X; Mfr_name: PANASONIC-ECG; Mistral Part No: 110009030506-R; Voltage: NA; Custom_Duty: 15%; Customs_HS_Code: 85332119; Project: RED EYE; Footprint Path: Y:\MIS_DATABASE\Library\ALTIUM_TOOL\PCB_FOOTPRINTS\Altium_Footprint_Lib.PcbLib; Library Path: Y:\MIS_DATABASE\Library\ALTIUM_TOOL\SCHEMATICS_PARTS\MS_DISCRETE_Library.schlib; MECHANICAL 3D STEP FILE: RES0402_0-5; Temperature: -55°C+155°C; Weight: 0.8g/1000pcs; PCB Footprint: RES0402_0-5; Library Ref: RESISTOR; Chkd/date: VASANTHA/291216; Crtd /date: GEETHA/260406; Datasheet: Y:\MIS_DATABASE\DATASHEETS\RESISTORS\ERJ12.PDF; Height: 0.40MM; Distributor_part_number: P220JCT-ND; Distributor_name: DIGIKEY; Package: 0402; Wattage: 1/16W; Tolerance: 5%
R482 R501 = RESISTOR_Dup5: RES 220E 1/16W 5% 0402; Mistral Part No: 110009030506-R; Mfr_name: PANASONIC-ECG; Mfr_part_number: ERJ-2GEJ221X; Part_type: RESISTORS\FIXED; Voltage: NA; Project: RED EYE; Customs_HS_Code: 85332119; Custom_Duty: 15%; Footprint Path: Y:\MIS_DATABASE\Library\ALTIUM_TOOL\PCB_FOOTPRINTS\Altium_Footprint_Lib.PcbLib; Library Path: Y:\MIS_DATABASE\Library\ALTIUM_TOOL\SCHEMATICS_PARTS\MS_DISCRETE_Library.schlib; MECHANICAL 3D STEP FILE: RES0402_0-5; Temperature: -55°C+155°C; Weight: 0.8g/1000pcs; PCB Footprint: RES0402_0-5; Library Ref: RESISTOR; Tolerance: 5%; Wattage: 1/16W; Package: 0402; Distributor_name: DIGIKEY; Distributor_part_number: P220JCT-ND; Height: 0.40MM; Datasheet: Y:\MIS_DATABASE\DATASHEETS\RESISTORS\ERJ12.PDF; Crtd /date: GEETHA/260406; Chkd/date: VASANTHA/291216
R506 = RESISTOR_Dup5: RES 10K 1/16W 5% 0402; Mistral Part No: 110009030208-R; Mfr_name: YAGEO AMERICA; Mfr_part_number: RC0402JR-0710KL; Part_type: RESISTORS\FIXED; Project: HSE; Voltage: NA; Customs_HS_Code: 85332119; Custom_Duty: 15%; Footprint Path: Y:\MIS_DATABASE\Library\ALTIUM_TOOL\PCB_FOOTPRINTS\Altium_Footprint_Lib.PcbLib; Library Path: Y:\MIS_DATABASE\Library\ALTIUM_TOOL\SCHEMATICS_PARTS\MS_DISCRETE_Library.schlib; Footprint Ref: RES0402_0-5; Library Ref: RESISTOR; PCB Footprint: RES0402_0-5; Tolerance: 5%; Wattage: 1/16W; Package: 0402; Distributor_name: DIGIKEY; Distributor_part_number: 311-10KJRCT-ND; Height: 0.40MM; Weight: 0.65mg; Temperature: -55°C+155°C; Datasheet: Y:\MIS_DATABASE\DATASHEETS\RESISTORS\YAGEO-RC0402.PDF; Crtd /date: MAZHAR/230805; Chkd/date: VASANTHA/061216; RoHS: Pb-Free; MECHANICAL 3D STEP FILE: RES0402_0-5
R513 = RESISTOR_Dup5: RES 10K 1/16W 5% 0402; Mistral Part No: 110009030208-R; Mfr_name: YAGEO AMERICA; Mfr_part_number: RC0402JR-0710KL; Part_type: RESISTORS\FIXED; Project: HSE; Voltage: NA; Customs_HS_Code: 85332119; Custom_Duty: 15%; NI_MARK: DNI; Footprint Path: Y:\MIS_DATABASE\Library\ALTIUM_TOOL\PCB_FOOTPRINTS\Altium_Footprint_Lib.PcbLib; Library Path: Y:\MIS_DATABASE\Library\ALTIUM_TOOL\SCHEMATICS_PARTS\MS_DISCRETE_Library.schlib; Footprint Ref: RES0402_0-5; Library Ref: RESISTOR; PCB Footprint: RES0402_0-5; Tolerance: 5%; Wattage: 1/16W; Package: 0402; Distributor_name: DIGIKEY; Distributor_part_number: 311-10KJRCT-ND; Height: 0.40MM; Weight: 0.65mg; Temperature: -55°C+155°C; Datasheet: Y:\MIS_DATABASE\DATASHEETS\RESISTORS\YAGEO-RC0402.PDF; Crtd /date: MAZHAR/230805; Chkd/date: VASANTHA/061216; RoHS: Pb-Free; MECHANICAL 3D STEP FILE: RES0402_0-5
R514 = RESISTOR_Dup5: RES 10K 1/16W 5% 0402; Part_type: RESISTORS\FIXED; Mfr_part_number: RC0402JR-0710KL; Mfr_name: YAGEO AMERICA; Mistral Part No: 110009030208-R; Custom_Duty: 15%; Customs_HS_Code: 85332119; Voltage: NA; Project: HSE; NI_MARK: DNI; Footprint Path: Y:\MIS_DATABASE\Library\ALTIUM_TOOL\PCB_FOOTPRINTS\Altium_Footprint_Lib.PcbLib; Library Path: Y:\MIS_DATABASE\Library\ALTIUM_TOOL\SCHEMATICS_PARTS\MS_DISCRETE_Library.schlib; Footprint Ref: RES0402_0-5; Library Ref: RESISTOR; PCB Footprint: RES0402_0-5; MECHANICAL 3D STEP FILE: RES0402_0-5; RoHS: Pb-Free; Chkd/date: VASANTHA/061216; Crtd /date: MAZHAR/230805; Datasheet: Y:\MIS_DATABASE\DATASHEETS\RESISTORS\YAGEO-RC0402.PDF; Temperature: -55°C+155°C; Weight: 0.65mg; Height: 0.40MM; Distributor_part_number: 311-10KJRCT-ND; Distributor_name: DIGIKEY; Package: 0402; Wattage: 1/16W; Tolerance: 5%
RA2 RA4 = RESARR_ISO4: RES ARRAY 22E 31mW 5% 0402; Part_type: RESISTORS\ARRAY; Mfr_part_number: EXB-28V220JX; Mfr_name: PANASONIC-ECG; Mistral Part No: 110009030021-R; Voltage: NA; Project: KHAN_MAIN; SIGNAL_MODEL: RESA1; Library Ref: RESARR_ISO4; PCB Footprint: RESA_EXB28V_0402-4_0-5; MECHANICAL 3D STEP FILE: RESA_EXB28V_0402-4_0-5; Chkd/date: MAZHAR/291208; Crtd /date: USMAN/261108; Datasheet: Y:\MIS_DATABASE\DATASHEETS\RESISTORS\EXB-2HV.PDF; Temperature: -55°C+125°C; Weight: 2mg; Height: 0.45MM; Distributor_part_number: Y7220CT-ND; Distributor_name: DIGIKEY; Package: 0402; Wattage: 31mW; Tolerance: 5%
TP16 = TESTPOINT: TESTPOINT CIR 40 SMD; Mfr_name: LOCAL; Mistral Part No: 130009030933; MECHANICAL 3D STEP FILE: NA; Project: RAINIER-3; NI_MARK: DNI; RoHS: NA; Footprint Ref: TP40_SMD; Library Ref: TESTPOINT; PCB Footprint: TP40_SMD; Footprint Path: Y:\MIS_DATABASE\Library\ALTIUM_TOOL\PCB_FOOTPRINTS\Altium_Footprint_Lib.PcbLib; Library Path: Y:\MIS_DATABASE\Library\ALTIUM_TOOL\SCHEMATICS_PARTS\MS_DISCRETE_Library.schlib; Datasheet: NA; Temperature: NA; Weight: NA; Wattage: NA; Voltage: NA; Tolerance: NA; Chkd/date: MAZHAR/190505; Crtd /date: MAZHAR/190505; Height: NA; Distributor_part_number: NA; Distributor_name: NA; Package: SMD; Part_type: TESTPOINT; Mfr_part_number: TP40_SMD
TP17 = TESTPOINT: TESTPOINT CIR 40 SMD; Mfr_name: LOCAL; Mistral Part No: 130009030933; Project: RAINIER-3; Tolerance: NA; NI_MARK: DNI; RoHS: NA; Footprint Ref: TP40_SMD; Library Ref: TESTPOINT; PCB Footprint: TP40_SMD; Chkd/date: MAZHAR/190505; Crtd /date: MAZHAR/190505; Height: NA; Distributor_part_number: NA; Distributor_name: NA; Package: SMD; Part_type: TESTPOINT; Mfr_part_number: TP40_SMD; Voltage: NA; Wattage: NA; Weight: NA; Temperature: NA; Datasheet: NA; MECHANICAL 3D STEP FILE: NA; Library Path: Y:\MIS_DATABASE\Library\ALTIUM_TOOL\SCHEMATICS_PARTS\MS_DISCRETE_Library.schlib; Footprint Path: Y:\MIS_DATABASE\Library\ALTIUM_TOOL\PCB_FOOTPRINTS\Altium_Footprint_Lib.PcbLib
U31 = DP83867IRRGZ_VQFN48: IC HIGH IMMUNITY 10/100/1000 Mb/s ETHERNET PHY LAYER TRANSCEIVER VQFN48; Part_type: ICS\TELECOM\TRANSCEIVER; Mfr_name: TEXAS INSTRUMENTS; Mistral Part No: 143017080002-R; Custom_Duty: 15%; Customs_HS_Code: 85423100; Wattage: NA; Project: TI_SVB_CONTROLLER CARD; Library Ref: DP83867IRRGZ_VQFN48; PCB Footprint: QFN48_19-68_280X280_1; MECHANICAL 3D STEP FILE: QFN48_19-68_280X280_1; Chkd/date: MANIRAJA/110817; Crtd /date: MANIRAJA/110817; Datasheet: Y:\MIS_DATABASE\DATASHEETS\ICS\DIGITAL\BUSTRANSCEIVER\DP83867I.PDF; Temperature: -40°C+85°C; Weight: NA; Height: 1.00MM; Distributor_part_number: DP83867IRRGZT-ND; Distributor_name: DIGIKEY; Package: VQFN48; Voltage: NA; Tolerance: NA; Mfr_part_number: DP83867IRRGZ
U34 = AM654X_BGA784: IC MAXWELL MICRO CONTROLLER UNIT BGA784; Part_type: ICS\DIGITAL\MICROCONTROLLER; Mfr_part_number: MAXWELL M4_EVM; Mfr_name: TEXAS INSTRUMENTS; Mistral Part No: 141217100003; Custom_Duty: 15%; Customs_HS_Code: 85423100; Wattage: NA; Project: TI_MAXIE_CPB; Library Ref: AM654X_BGA784; MECHANICAL 3D STEP FILE: BGA784_31-49_910X910_1-7; Chkd/date: MANIRAJA/130717; Crtd /date: MANIRAJA/130717; Datasheet: Y:\MIS_DATABASE\DATASHEETS\ICS\DIGITAL\MICROCONTROLLER\MAXWELLM4.PDF; Temperature: NA; Weight: NA; Height: 1.63MM; Distributor_part_number: NA; Distributor_name: NA; Package: BGA784; Voltage: NA; Tolerance: NA; PCB Footprint: BGA784_31-49_910X910_1-7
U86 = SN74LVC1G08DBVRE4_SOT23-5: IC SINGLE 2-INPUT POSITIVE AND GATE SOT23-5; Part_type: ICS\DIGITAL\GATES; Mfr_name: TEXAS INSTRUMENTS; Mistral Part No: 141009060026-R; Custom_Duty: 15%; Customs_HS_Code: 85423100; Project: KHAN_MAIN; Library Ref: SN74LVC1G08DBVRE4_SOT23-5; PCB Footprint: SOT23-5; RoHS: Sb/ Br FREE; Chkd/date: SUHAS/221010; Crtd /date: USMAN/151008; Datasheet: Y:\MIS_DATABASE\DATASHEETS\ICS\DIGITAL\GATES\SN74LVC1G08.PDF; Temperature: -40°C+85°C; Height: 1.45MM; Distributor_part_number: SN74LVC1G08DBVRE4-ND; Distributor_name: DIGIKEY; Package: SOT23-5; Mfr_part_number: SN74LVC1G08DBVRE4